# EAGLE schematic quadcopter (EAGLE 9.7.0)
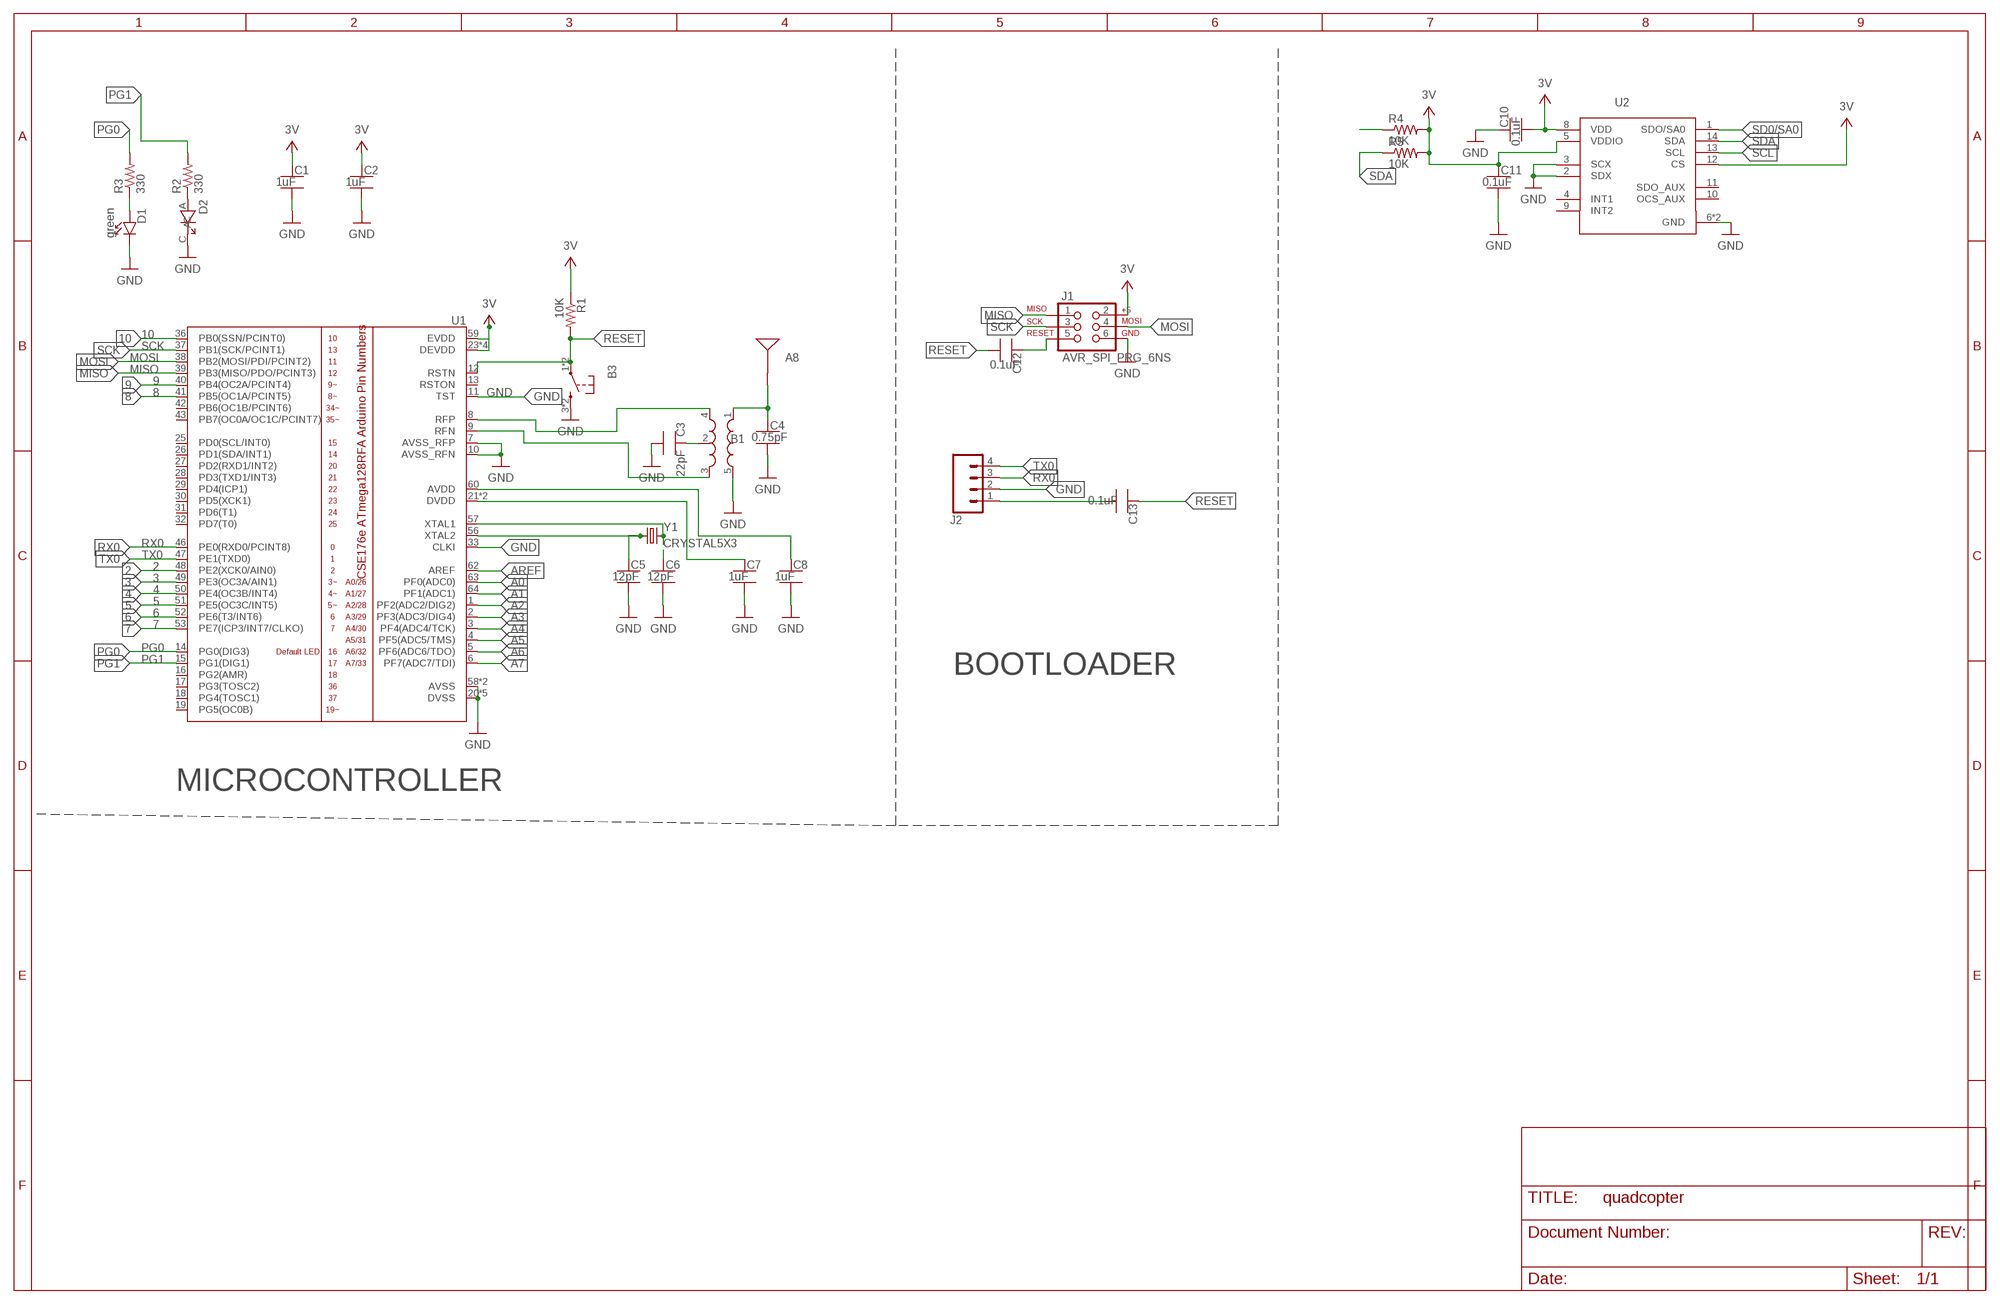
[diagram p0: schematic, sheet 1]
FRAME1 (FRAME_B_L): CREATOR: Unknown; DIST: Unknown; DISTPN: Unknown

## Parts
A8  ANTENNA-BOARD  [ANT_PCB_2.4GHZ_NRF8001_1.6MM_1OZ]
B1  BALUN0805  [BALUN]
B3  PUSHBUTTON_SMD-VERTICAL-1  [TE_FSM8JSMA_HS]
C1  1uF  CAPACITOR-NP_SMD-2012-0805_CERAMIC-1UF  [CAPC2012X140_HS]
C2  1uF  CAPACITOR-NP_SMD-2012-0805_CERAMIC-1UF  [CAPC2012X140_HS]
C3  22pF  CAPACITOR-NP_SMD-2012-0805_CERAMIC-22PF  [CAPC2012X140_HS]
C4  0.75pF  CAPACITOR-NP_SMD-2012-0805_CERAMIC-0.75PF  [CAPC2012X140_HS]
C5  12pF  CAPACITOR-NP_SMD-2012-0805_CERAMIC-12PF  [CAPC2012X140_HS]
C6  12pF  CAPACITOR-NP_SMD-2012-0805_CERAMIC-12PF  [CAPC2012X140_HS]
C7  1uF  CAPACITOR-NP_SMD-2012-0805_CERAMIC-1UF  [CAPC2012X140_HS]
C8  1uF  CAPACITOR-NP_SMD-2012-0805_CERAMIC-1UF  [CAPC2012X140_HS]
C10  0.1uF  CAPACITOR-NP_SMD-2012-0805_CERAMIC-0.1UF  [CAPC2012X140_HS]
C11  0.1uF  CAPACITOR-NP_SMD-2012-0805_CERAMIC-0.1UF  [CAPC2012X140_HS]
C12  0.1uF  CAPACITOR-NP_SMD-2012-0805_CERAMIC-0.1UF  [CAPC2012X140_HS]
C13  0.1uF  CAPACITOR-NP_SMD-2012-0805_CERAMIC-0.1UF  [CAPC2012X140_HS]
D1  green  DIODE-LED_SMD-2012-0805-GREEN  [LEDSC125X200X120-2_HS]
D2  LED-RED-160-1178-1-ND  [LED_160-1178-1-ND]
J1  AVR_SPI_PRG_6NS  [2X3-NS]
J2  HEADER-4POS-2X2-0.1IN-FEMALE-SMD-BOTTOM-ENTRY  [CONN4_969973-2]
R1  10K  RESISTOR_SMD-2012-0805-10K  [RESC2012X60_HS]
R2  330  RESISTOR_SMD-2012-0805-330  [RESC2012X60_HS]
R3  330  RESISTOR_SMD-2012-0805-330  [RESC2012X60_HS]
R4  10K  RESISTOR_SMD-2012-0805-10K  [RESC2012X60_HS]
R5  10K  RESISTOR_SMD-2012-0805-10K  [RESC2012X60_HS]
U1  ATMEGA128RFA1  [QFN-64]
U2  IMU-LSM6DSOXTR-497-18367-1-ND497-18367-1-ND  [LSM6DS0]
Y1  CRYSTAL5X3  [CRYSTAL-SMD-5X3]

## Nets
2: U1.48(PE2(XCK0/AIN0))
3: U1.49(PE3(OC3A/AIN1))
3V: C1.1 C2.1 C10.2 C11.1 J1.2 R1.1 R4.2 R5.2 U1.23(DEVDD) U1.34(DEVDD) U1.44(DEVDD) U1.54(DEVDD) U1.59(EVDD) U2.5(VDDIO) U2.8(VDD) U2.12(CS)
4: U1.50(PE4(OC3B/INT4))
5: U1.51(PE5(OC3C/INT5))
6: U1.52(PE6(T3/INT6))
7: U1.53(PE7(ICP3/INT7/CLKO))
8: U1.41(PB5(OC1A/PCINT5))
9: U1.40(PB4(OC2A/PCINT4))
10: U1.36(PB0(SSN/PCINT0))
A0: U1.63(PF0(ADC0))
A1: U1.64(PF1(ADC1))
A2: U1.1(PF2(ADC2/DIG2))
A3: U1.2(PF3(ADC3/DIG4))
A4: U1.3(PF4(ADC4/TCK))
A5: U1.4(PF5(ADC5/TMS))
A6: U1.5(PF6(ADC6/TDO))
A7: U1.6(PF7(ADC7/TDI))
AREF: U1.62(AREF)
GND: B1.5(GND) B3.3 B3.4 C1.2 C2.2 C3.2 C4.2 C5.2 C6.2 C7.2 C8.2 C10.1 C11.2 D1.C D2.C J1.6 J2.2 U1.7(AVSS_RFP) U1.10(AVSS_RFN) U1.11(TST) U1.20(DVSS) U1.24(DVSS) U1.33(CLKI) U1.35(DVSS) U1.45(DVSS) U1.55(DVSS) U1.58(AVSS) U1.61(AVSS) U2.2(SDX) U2.3(SCX) U2.6(GND) U2.7(GND)
MISO: J1.1 U1.39(PB3(MISO/PDO/PCINT3))
MOSI: J1.4 U1.38(PB2(MOSI/PDI/PCINT2))
N$1: D1.A R3.1
N$2: D2.A R2.1
N$4: B1.4(OUT1) U1.8(RFP)
N$5: B1.2(GND) C3.1
N$6: B1.3(OUT2) U1.9(RFN)
N$7: A8.FEED(SIGNAL) B1.1(IN) C4.1
N$8: C8.1 U1.60(AVDD)
N$9: C7.1 U1.21(DVDD) U1.22(DVDD)
N$10: C6.1 U1.57(XTAL1) Y1.3
N$11: C5.1 U1.56(XTAL2) Y1.1
N$13: R4.1
N$14: C12.2
N$15: C13.2 J2.1
PG0: R3.2 U1.14(PG0(DIG3))
PG1: R2.2 U1.15(PG1(DIG1))
RESET: B3.1 B3.2 C12.1 C13.1 J1.5 R1.2 U1.12(RSTN)
RX0: J2.3 U1.46(PE0(RXD0/PCINT8))
SCK: J1.3 U1.37(PB1(SCK/PCINT1))
SCL: U2.13(SCL)
SD0/SA0: U2.1(SDO/SA0)
SDA: R5.1 U2.14(SDA)
TX0: J2.4 U1.47(PE1(TXD0))
Unconnected: U1.13(RSTON) U1.16(PG2(AMR)) U1.17(PG3(TOSC2)) U1.18(PG4(TOSC1)) U1.19(PG5(OC0B)) U1.25(PD0(SCL/INT0)) U1.26(PD1(SDA/INT1)) U1.27(PD2(RXD1/INT2)) U1.28(PD3(TXD1/INT3)) U1.29(PD4(ICP1)) U1.30(PD5(XCK1)) U1.31(PD6(T1)) U1.32(PD7(T0)) U1.42(PB6(OC1B/PCINT6)) U1.43(PB7(OC0A/OC1C/PCINT7)) U2.4(INT1) U2.9(INT2) U2.10(OCS_AUX) U2.11(SDO_AUX)

## Notes on the sheet
- BOOTLOADER
- MICROCONTROLLER

## Library data of the parts
A8 = quadparts_prebuilt_2022:ANTENNA: Single endded antenna.; CREATOR: Swanson; DESC: trace antenna; DIST: NA; DISTPN: NA; MFR: NA; MOUNTING: NONE; MPN: NA; POPULATE: NO
B1 = quadparts_prebuilt_2022:BALUN: A balun to convert differential radio-frequency outputs from the microcontroller into a single-ended driver for the antenna.; CREATOR: Swanson; DATASHEET: http://katalog.we-online.de/pbs/datasheet/748421245.pdf; DESC: BALUN 2.4GHZ-2.5GHZ 50/100 0805; DIST: Digikey; DISTPN: 732-2230-1-ND; MFR: Wurth Electronics Inc.; MOUNTING: SMD; MPN: 748421245; PACKAGE: 0805; PRICE: 2.63; REVIEWER: Swanson
B3 = quadparts_prebuilt_2022:PUSHBUTTON_: "Tactile" or "clicky" button.; CREATOR: Swanson; DIST: Digikey; DISTPN: 450-1129-ND; MFR: TE Connectivity Alcoswitch Switches; MOUNTING: SMD; MPN: FSM4JSMA; REVIEWER: Swanson
C1 C2 C7 C8 = quadparts_prebuilt_2022:CAPACITOR-NP_: Nonpolarized capacitor; CREATOR: Swanson; DIST: Digikey; DISTPN: 587-1281-1-ND; MFR: Taiyo Yuden; MOUNTING: SMD; MPN: TMK212B7105KG-T; REVIEWER: Swanson
C3 = quadparts_prebuilt_2022:CAPACITOR-NP_: Nonpolarized capacitor; CREATOR: Swanson; DESC: CAP CER 22PF 250V C0G/NP0 0805; DIST: Digikey; DISTPN: 490-5534-1-ND; MFR: Murata Electronics; MOUNTING: SMD; MPN: GRM21A5C2E220JW01D; PACKAGE: 0805; REVIEWER: Swanson
C4 = quadparts_prebuilt_2022:CAPACITOR-NP_: Nonpolarized capacitor; CREATOR: Swanson; DESC: CAP CER 0.75PF 100V C0G/NP0 0805; DIST: Digikey; DISTPN: 490-3585-1-ND; MFR: Murata Electronics; MOUNTING: SMD; MPN: GQM2195C2AR75CB01D; PACKAGE: 0805; REVIEWER: Swanson
C5 C6 = quadparts_prebuilt_2022:CAPACITOR-NP_: Nonpolarized capacitor; CREATOR: Swanson; DESC: CAP CER 12PF 250V C0G/NP0 0805; DIST: Digikey; DISTPN: 490-5531-1-ND; MFR: Murata Electronics; MOUNTING: SMD; MPN: GRM21A5C2E120JW01D; PACKAGE: 0805; REVIEWER: Swanson
C10-C13 = quadparts_prebuilt_2022:CAPACITOR-NP_: Nonpolarized capacitor; CREATOR: Swanson; DESC: CAP CER 0.1UF 100V X7R 0805; DIST: Digikey; DISTPN: 445-1418-1-ND; MFR: TDK Corporation; MOUNTING: SMD; MPN: C2012X7R2A104K125AA; PACKAGE: 0805; REVIEWER: Swanson
D1 = quadparts_prebuilt_2022:DIODE-LED_: Light emitting diode; CREATOR: Swanson; DIST: Digikey; DISTPN: 160-1179-1-ND; MFR: Lite-On Inc; MOUNTING: SMD; MPN: LTST-C170GKT; REVIEWER: Swanson
D2 = custom_v9:LED; CREATOR: KaustubhKanagalekar; DIST: Digikey; DISTPN: 160-1178-1-ND
J1 = quadparts_prebuilt_2022:AVR_SPI_PRG_6: AVR ISP 6 Pin This is the in-system programming (ISP) connector for Atmel Microcontrollers programming.; CREATOR: Swanson; DATASHEET: http://portal.fciconnect.com/Comergent//fci/drawing/67996.pdf; DIST: Digikey; DISTPN: 609-3234-ND; MFR: Amphenol FCI; MOUNTING: TH; MPN: 67997-206HLF; PRICE: 0.31; REVIEWER: Swanson
J2 = quadparts_prebuilt_2022:HEADER-4POS; CREATOR: DIGIKEY; DIST: DIGIKEY; DISTPN: A107056CT-ND; MANUFACTURER_PART_NUMBER: 9699732; MOUNTING: SMD; VENDOR: TE Connectivity
R1 R4 R5 = quadparts_prebuilt_2022:RESISTOR_: Resistor; CREATOR: Swanson; DESC: RES SMD 10K OHM 5% 1/8W 0805; DIST: Digikey; DISTPN: 311-10KARCT-ND; MFR: Yageo; MOUNTING: SMD; MPN: RC0805JR-0710KL; PACKAGE: 0805; REVIEWER: Swanson
R2 R3 = quadparts_prebuilt_2022:RESISTOR_: Resistor; CREATOR: Swanson; DIST: Digikey; DISTPN: 311-330ARCT-ND; MFR: Yageo; MOUNTING: SMD; MPN: RC0805JR-07330RL; REVIEWER: Swanson
U1 = quadparts_prebuilt_2022:ATMEGA128RFA1: ATmega128RFA1 8-bit AVR Microcontroller with Low Power 2.4GHz Transceiver for ZigBee and IEEE 802.15.4; CREATOR: Swanson; DATASHEET: http://www.atmel.com/Images/Atmel-8266-MCU_Wireless-ATmega128RFA1_Datasheet.pdf; DESC: IC RF TXRX+MCU 802.15.4 64VFQFN; DIST: Digikey; DISTPN: ATMEGA128RFA1-ZU-ND; MFR: Microchip Technology; MOUNTING: SMD; MPN: ATMEGA128RFA1-ZU; PACKAGE: QFN; PRICE: 10.21; REVIEWER: Swanson
U2 = custom_v9:IMU-LSM6DSOXTR-497-18367-1-ND; CREATOR: KaustubhKanagalekar; DIST: Digikey; DISTPN: 497-18367-1-ND
Y1 = quadparts_prebuilt_2022:CRYSTAL: Crystals to provide clock references for microcontrollers, etc.; CREATOR: Swanson; DATASHEET: http://www.abracon.com/Resonators/abm3b.pdf; DESC: CRYSTAL 16.0000MHZ 18PF SMD; DIST: Digikey; DISTPN: 535-9122-1-ND; MFR: Abracon LLC; MOUNTING: SMD; MPN: ABM3B-16.000MHZ-B2-T; PRICE: 0.68; PROD_ID: XTAL-08218; REVIEWER: Swanson